# EAGLE schematic ShineSensor (EAGLE 9.1.0)
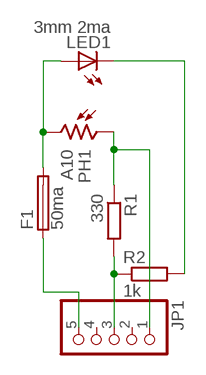
[diagram p0: schematic, sheet 1]

## Parts
F1  50ma  MF-SMDF050  [MF-SMDF050]
JP1  PINHD-1X5/90  [1X05/90]
LED1  3mm 2ma  TLLY4400  [LED3MM]
PH1  A10  A1050_11  [T0-46-A10XX]
R1  330  R-EU_R1206  [R1206]
R2  1k  R-EU_R1206  [R1206]

## Nets
N$1: F1.2 LED1.A PH1.2
N$2: LED1.K(C) R2.2
N$13: JP1.1 PH1.1 R1.1
N$14: JP1.3 R1.2 R2.1
N$15: F1.1 JP1.5
Unconnected: JP1.2 JP1.4

## Library data of the parts
F1 = fuse:MF-SMDF: MF-SMDF Series - PRC Resettable Fuses Source: http://www.farnell.com/datasheets/716597.pdf
JP1 = pinhead:PINHD-1X5: PIN HEADER
LED1 = led:TLLY4400: Low Current (2mA) LED 3 mm Tinted Diffused Package color YELLOW Source: Data sheet <http://www.farnell.com/datasheets/391098.pdf>; MF: VISHAY SEMICONDUCTOR; OC_FARNELL: 1612439
PH1 = photo-elements:A10: Sensor Robust Light Sensing Applications Outdoor Light Sensing Application Source: http://optoelectronics.perkinelmer.com/content/Datasheets/DTS_PhotocellsA1050.pdf
R1 R2 = rcl:R-EU_: RESISTOR, European symbol